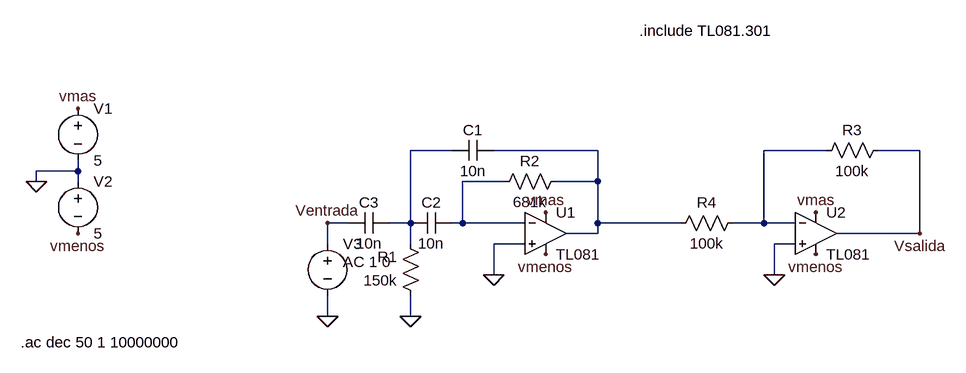
[diagram p0: schematic TPrehecho.asc]
TPrehecho.asc, the LTspice schematic file:
Version 4
SHEET 1 916 680
WIRE 96 112 32 112
WIRE 320 112 160 112
WIRE 672 112 576 112
WIRE 816 112 752 112
WIRE -480 144 -480 128
WIRE -480 144 -544 144
WIRE -544 160 -544 144
WIRE -480 160 -480 144
WIRE 176 160 112 160
WIRE 320 160 320 112
WIRE 320 160 256 160
WIRE -64 224 -96 224
WIRE 32 224 32 112
WIRE 32 224 0 224
WIRE 112 224 112 160
WIRE 112 224 96 224
WIRE 208 224 112 224
WIRE 320 224 320 160
WIRE 448 224 320 224
WIRE 576 224 576 112
WIRE 576 224 528 224
WIRE 624 224 576 224
WIRE 320 240 320 224
WIRE 320 240 272 240
WIRE 816 240 816 112
WIRE 816 240 688 240
WIRE -96 256 -96 224
WIRE 32 256 32 224
WIRE 208 256 160 256
WIRE 624 256 592 256
WIRE 160 304 160 256
WIRE 592 304 592 256
WIRE -96 368 -96 336
WIRE 32 368 32 336
FLAG -544 160 0
FLAG 592 304 0
FLAG 160 304 0
FLAG 32 368 0
FLAG -480 48 vmas
FLAG 240 208 vmas
FLAG 656 208 vmas
FLAG -480 240 vmenos
FLAG 240 272 vmenos
FLAG 656 272 vmenos
FLAG 816 240 Vsalida
FLAG -96 224 Ventrada
FLAG -96 368 0
DATAFLAG 816 112 ""
DATAFLAG 816 144 ""
DATAFLAG 752 240 ""
SYMBOL Opamps\\opamp2 240 176 R0
SYMATTR InstName U1
SYMATTR Value TL081
SYMATTR SpiceModel TL081
SYMBOL Opamps\\opamp2 656 176 R0
SYMATTR InstName U2
SYMATTR Value TL081
SYMATTR SpiceModel TL081
SYMBOL voltage -480 32 R0
WINDOW 123 0 0 Left 0
WINDOW 39 0 0 Left 0
SYMATTR InstName V1
SYMATTR Value 5
SYMBOL voltage -480 144 R0
WINDOW 123 0 0 Left 0
WINDOW 39 0 0 Left 0
SYMATTR InstName V2
SYMATTR Value 5
SYMBOL res 272 144 R90
WINDOW 0 0 56 VBottom 2
WINDOW 3 32 56 VTop 2
SYMATTR InstName R2
SYMATTR Value 681k
SYMBOL res 48 352 R180
WINDOW 0 36 76 Left 2
WINDOW 3 36 40 Left 2
SYMATTR InstName R1
SYMATTR Value 150k
SYMBOL res 656 128 R270
WINDOW 0 32 56 VTop 2
WINDOW 3 0 56 VBottom 2
SYMATTR InstName R3
SYMATTR Value 100k
SYMBOL res 432 240 R270
WINDOW 0 32 56 VTop 2
WINDOW 3 0 56 VBottom 2
SYMATTR InstName R4
SYMATTR Value 100k
SYMBOL cap 160 96 R90
WINDOW 0 0 32 VBottom 2
WINDOW 3 32 32 VTop 2
SYMATTR InstName C1
SYMATTR Value 10n
SYMBOL cap 96 208 R90
WINDOW 0 0 32 VBottom 2
WINDOW 3 32 32 VTop 2
SYMATTR InstName C2
SYMATTR Value 10n
SYMBOL cap 0 208 R90
WINDOW 0 0 32 VBottom 2
WINDOW 3 32 32 VTop 2
SYMATTR InstName C3
SYMATTR Value 10n
SYMBOL voltage -96 240 R0
WINDOW 123 24 44 Left 2
WINDOW 39 0 0 Left 0
WINDOW 3 24 72 Left 2
SYMATTR Value2 AC 1 0
SYMATTR Value ""
SYMATTR InstName V3
TEXT 384 -72 Left 2 !.include TL081.301
TEXT -568 408 Left 2 !.ac dec 50 1 10000000

The netlist it stands for:
* TPrehecho.asc
XU1 0 N004 vmas vmenos N002 TL081 TL081  ; pins In+ In- V+ V- OUT
XU2 0 N003 vmas vmenos Vsalida TL081 TL081  ; pins In+ In- V+ V- OUT
V1 vmas 0 5
V2 0 vmenos 5
R2 N002 N004 681k
R1 0 N001 150k
R3 N003 Vsalida 100k
R4 N002 N003 100k
C1 N002 N001 10n
C2 N004 N001 10n
C3 N001 Ventrada 10n
V3 Ventrada 0 AC 1 0
.include TL081.301
.ac dec 50 1 10000000
.backanno
.end